# EAGLE schematic schema (EAGLE 9.6.2)
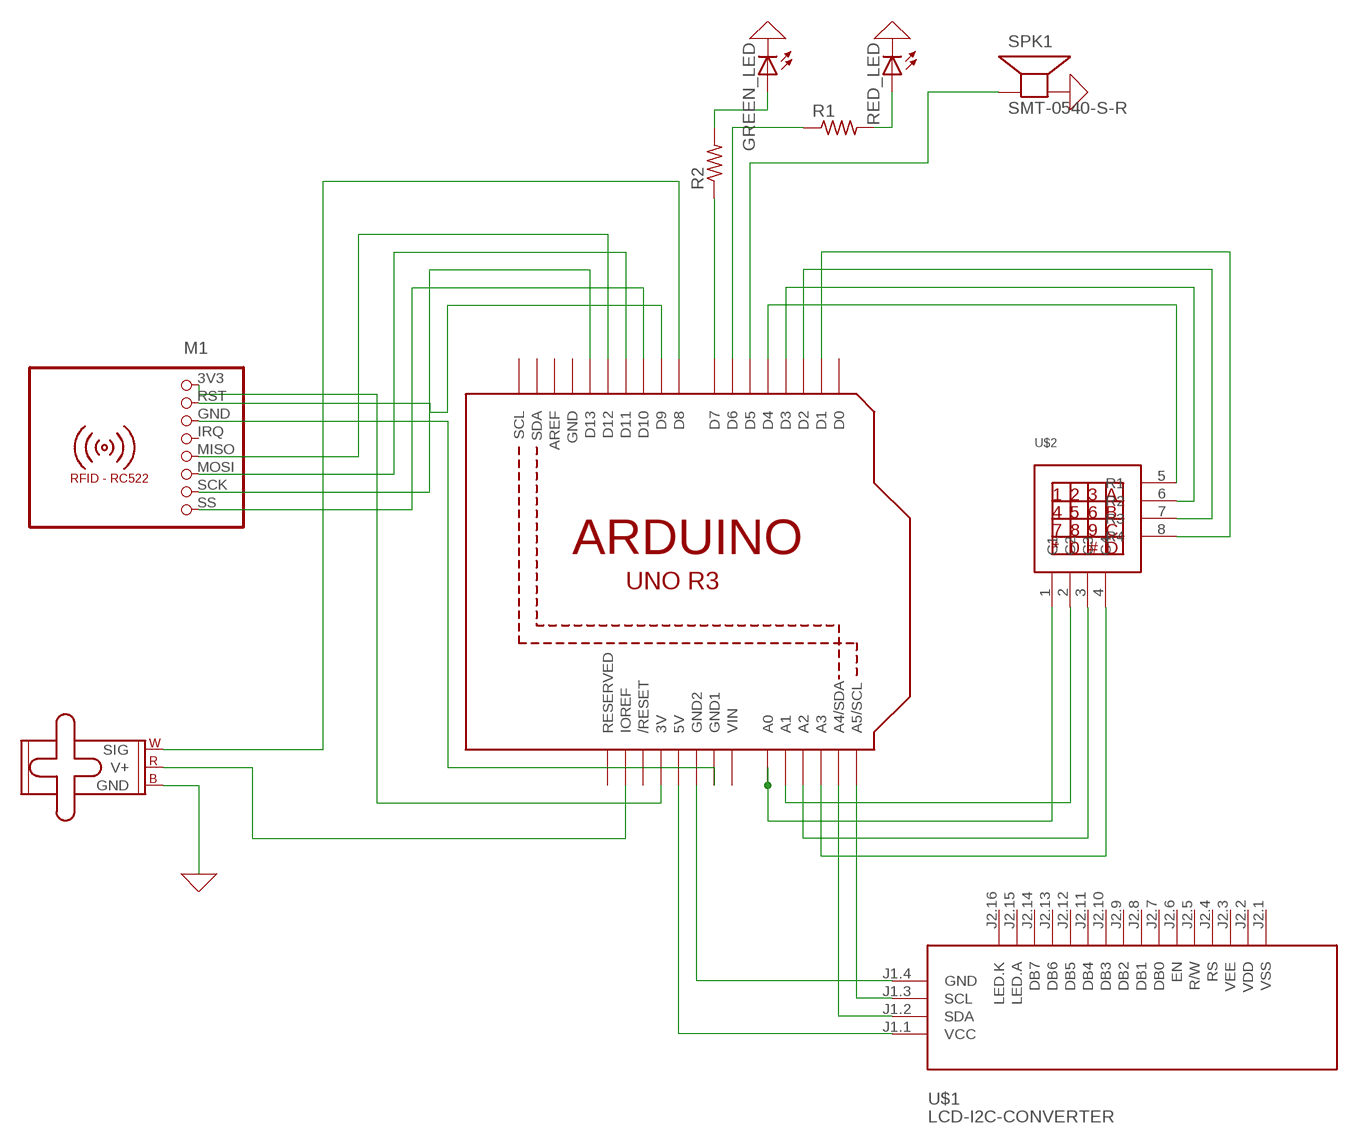
[diagram p0: schematic, sheet 1]

## Parts
GREEN_LED  LED  [SMARTLED-TTW]
M1  RFID-RC522  [RFID-RC522]
M2  SMALL_SERVO  [1X03]
R1  FLIPFLOP-RES  [0805-THM]
R2  FLIPFLOP-RES  [0805-THM]
RED_LED  LED  [SMARTLED-TTW]
SPK1  SMT-0540-S-R  [SMT-0540-S-R]
U1  ARDUINOR3-BPLACE  [ARDUINOR3-BPLACE]
U$1  LCD-I2C-CONVERTER  [LCD-I2C-CONVERTER]
U$2  KEYPAD4X4  [KEYPAD4X4]

## Nets
0: GREEN_LED.C@1(C) RED_LED.C@1(C) SPK1.+(-) ; supply symbol labelled GND
N$1: U1.GND2 U$1.J1.4(GND)
N$2: U1.5V U$1.J1.1(VCC)
N$3: U1.A5(A5/SCL) U$1.J1.3(SCL)
N$4: U1.A4(A4/SDA) U$1.J1.2(SDA)
N$5: M1.3V3 U1.3V
N$6: M1.RST U1.D9
N$7: M1.GND U1.GND1
N$8: M1.SS U1.D10
N$9: M1.SCK U1.D13
N$10: M1.MOSI U1.D11
N$11: M1.MISO U1.D12
N$12: M2.2(V+) U1.IOREF
N$13: M2.1(SIG) U1.D8
N$14: M2.3(GND) ; supply symbol labelled GND
N$15: U1.A0 U$2.1(C1)
N$16: U1.A1 U$2.2(C2)
N$17: U1.A2 U$2.3(C3)
N$18: U1.A3 U$2.4(C4)
N$19: U1.D4 U$2.5(R1)
N$20: U1.D3 U$2.6(R2)
N$21: U1.D2 U$2.7(R3)
N$22: U1.D1 U$2.8(R4)
N$23: R2.1 U1.D7
N$24: R1.1 U1.D6
N$25: SPK1.-(+) U1.D5
N$26: R1.2 RED_LED.A@1(A)
N$27: GREEN_LED.A@1(A) R2.2
Unconnected: M1.IRQ U1.AREF U1.D0 U1.RESERVED U1.RESET(/RESET) U1.SCL U1.SDA U$1.J2.1(VSS) U$1.J2.2(VDD) U$1.J2.3(VEE) U$1.J2.4(RS) U$1.J2.5(R/W) U$1.J2.6(EN) U$1.J2.7(DB0) U$1.J2.8(DB1) U$1.J2.9(DB2) U$1.J2.10(DB3) U$1.J2.11(DB4) U$1.J2.12(DB5) U$1.J2.13(DB6) U$1.J2.14(DB7) U$1.J2.15(LED.A) U$1.J2.16(LED.K)

## Power pins joined to a net without a drawn wire
GND: U1.GND
VIN: U1.VIN

## Library data of the parts
GREEN_LED RED_LED = adafruit:LED: LED OSRAM: - CHIPLED LG R971, LG N971, LY N971, LG Q971, LY Q971, LO R971, LY R971 LH N974, LH R974 LS Q976, LO Q976, LY Q976 LO Q996 - Hyper CHIPLED LW Q18S LB Q993, LB Q99A, LB R99A - SideLED LS A670, LO A670, LY A670, LG A670, LP A670 LB A673, LV A673, LT A673, LW A673 LH A674 LY A675 LS A676, LA A676, LO A676, LY A676, LW A676 LS A679, LY A679, LG A679 - Hyper Micro SIDELED® LS Y876, LA Y876, LO Y876, LY Y876 LT Y87S - SmartLED LW L88C, LW L88S LB L89C, LB L89S, LG L890 LS L89K, LO L89K, LY L89K LS L896, LA L896, LO L896, LY L896 - TOPLED LS T670, LO T670, LY T670, LG T670, LP T670 LSG T670, LSP T670, LSY T670, LOP T670, LYG T670 LG T671, LOG T671, LSG T671 LB T673, LV T673, LT T673, LW T673 LH T674 LS T676, LA T676, LO T676, LY T676, LB T676, LH T676, LSB T676, LW T676 LB T67C, LV T67C, LT T67C, LS T67K, LO T67K, LY T67K, LW E67C LS E67B, LA E67B, LO E67B, LY E67B, LB E67C, LV E67C, LT E67C LW T67C LS T679, LY T679, LG T679 LS T770, LO T770, LY T770, LG T770, LP T770 LB T773, LV T773, LT T773, LW T773 LH T774 LS E675, LA E675, LY E675, LS T675 LS T776, LA T776, LO T776, LY T776, LB T776 LHGB T686 LT T68C, LB T68C - Hyper Mini TOPLED® LB M676 - Mini TOPLED Santana® LG M470 LS M47K, LO M47K, LY M47K Source: http://www.osram.convergy.de/
M1 = mfrc522-module:RFID-RC522: RFID-RC522 MFRC-522 based breakout board
M2 = SparkFun-Electromechanical:SMALL_SERVO: Small servo motor This is the small servo used in the SIK. SKU: ROB-09065
R1 R2 = adafruit:FLIPFLOP-RES: Flip Flop resistor An 0805 resistor inside a standard 1/4W 5% resistor. Makes for easy mods
SPK1 = adafruit:SMT-0540-S-R: SMT-0549-S-R Small surface-mount magnetic buzzer
U1 = adafruit:ARDUINOR3: This is a new object for the new Arduino R3 - with extra pins that you may want to use (such as IOref, and duplicated A4/A5
U$1 = diy-modules:LCD-I2C-CONVERTER: I2C Bus to 4-Bit Parallel LCD Interface with LED backlight driver
U$2 = keypad_4x4_raw:KEYPAD4X4